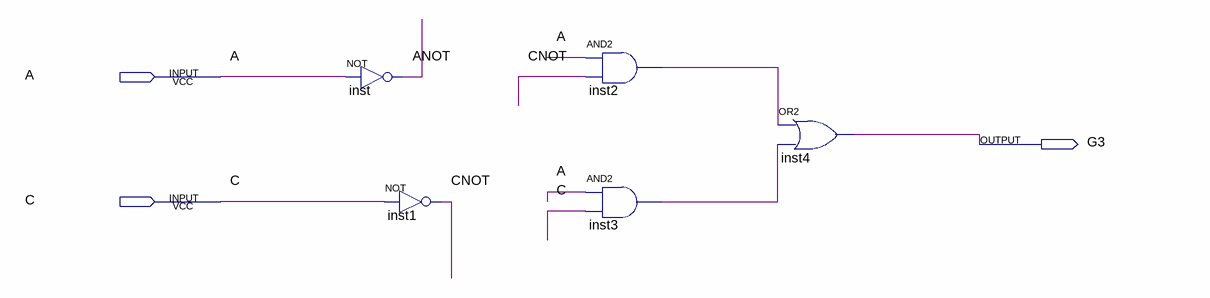
[diagram p0: schematic sheet]
// Quartus schematic Lab03G3.bdf as structural Verilog: 5 symbols, 3 pins
module Lab03G3 (
  input  A,
  input  C,
  output G3
);

  wire ANOT, CNOT, inst2_out, inst3_out;

  not inst (ANOT, A);
  not inst1 (CNOT, C);
  and inst2 (inst2_out, A, CNOT);
  and inst3 (inst3_out, A, C);
  or inst4 (G3, inst2_out, inst3_out);
endmodule
